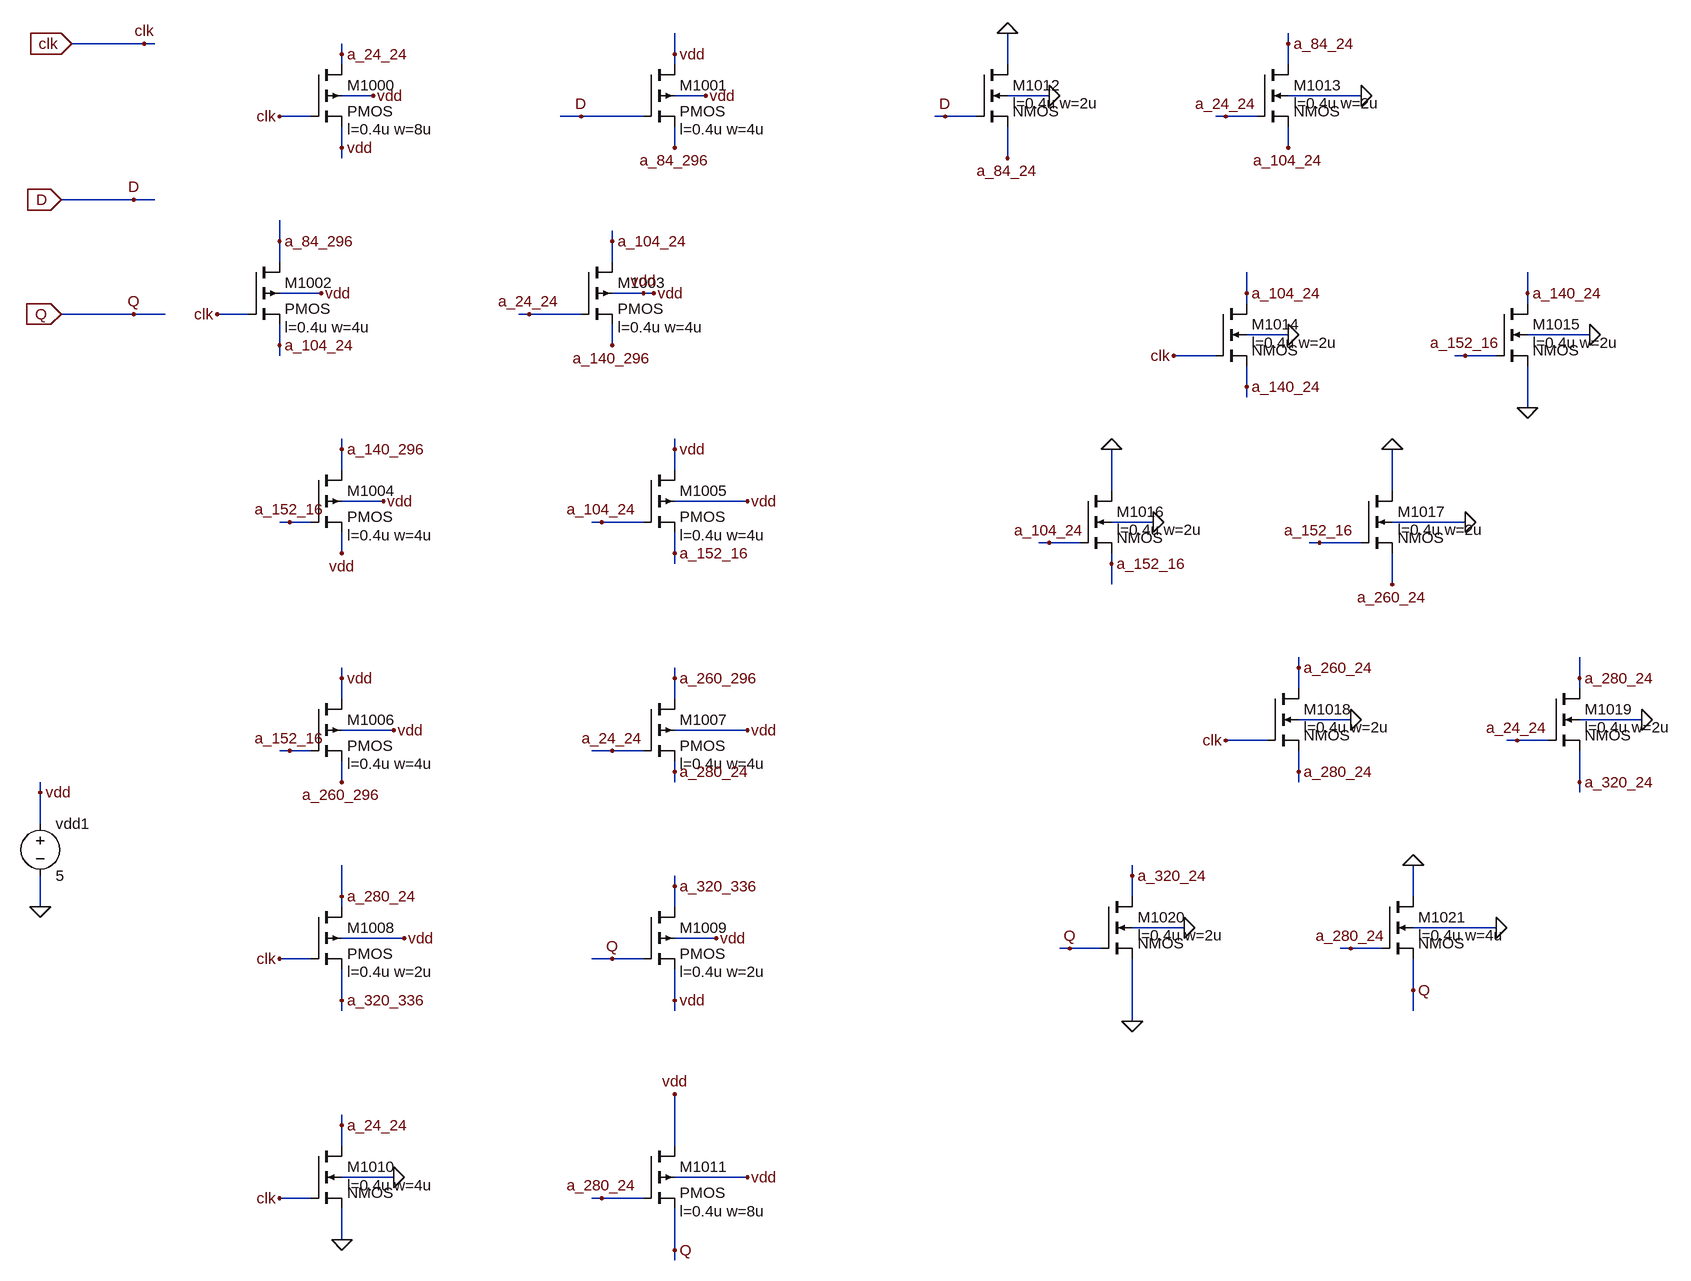
[diagram p0: schematic dff.asc]
dff.asc, the LTspice schematic file:
Version 4
SHEET 1 1748 1736
WIRE -624 -176 -736 -176
WIRE -608 -176 -624 -176
WIRE 1136 -176 1136 -192
WIRE -320 -160 -320 -176
WIRE 192 -160 192 -192
WIRE -320 -144 -320 -160
WIRE 192 -144 192 -160
WIRE 704 -144 704 -192
WIRE 1136 -144 1136 -176
WIRE -272 -96 -320 -96
WIRE 240 -96 192 -96
WIRE 768 -96 704 -96
WIRE 1248 -96 1136 -96
WIRE -368 -64 -416 -64
WIRE 48 -64 16 -64
WIRE 144 -64 48 -64
WIRE 608 -64 592 -64
WIRE 656 -64 608 -64
WIRE 1040 -64 1024 -64
WIRE 1088 -64 1040 -64
WIRE -320 -16 -320 -48
WIRE 192 -16 192 -48
WIRE 1136 -16 1136 -48
WIRE -320 0 -320 -16
WIRE 704 0 704 -48
WIRE -640 64 -752 64
WIRE -608 64 -640 64
WIRE -416 128 -416 96
WIRE 96 128 96 112
WIRE -416 160 -416 128
WIRE 96 160 96 128
WIRE -352 208 -416 208
WIRE 144 208 96 208
WIRE 160 208 144 208
WIRE 1072 208 1072 176
WIRE 1504 208 1504 176
WIRE 1072 224 1072 208
WIRE 1504 224 1504 208
WIRE -640 240 -752 240
WIRE -592 240 -640 240
WIRE -464 240 -512 240
WIRE -32 240 -48 240
WIRE 48 240 -32 240
WIRE 1136 272 1072 272
WIRE 1600 272 1504 272
WIRE -416 288 -416 256
WIRE 96 288 96 256
WIRE -416 304 -416 288
WIRE 1024 304 960 304
WIRE 1408 304 1392 304
WIRE 1456 304 1408 304
WIRE 1072 352 1072 320
WIRE 1072 368 1072 352
WIRE 1504 384 1504 320
WIRE -320 448 -320 432
WIRE 192 448 192 432
WIRE -320 480 -320 448
WIRE 192 480 192 448
WIRE 864 512 864 448
WIRE 1296 512 1296 448
WIRE -256 528 -320 528
WIRE 304 528 192 528
WIRE -400 560 -416 560
WIRE -368 560 -400 560
WIRE 80 560 64 560
WIRE 144 560 80 560
WIRE 928 560 864 560
WIRE 1408 560 1296 560
WIRE 768 592 752 592
WIRE 816 592 768 592
WIRE 1184 592 1168 592
WIRE 1248 592 1184 592
WIRE -320 608 -320 576
WIRE 192 608 192 576
WIRE 192 624 192 608
WIRE 864 624 864 608
WIRE 864 656 864 624
WIRE 1296 656 1296 608
WIRE 1152 784 1152 768
WIRE -320 800 -320 784
WIRE 192 800 192 784
WIRE 1584 800 1584 768
WIRE 1152 816 1152 784
WIRE 1584 816 1584 800
WIRE -320 832 -320 800
WIRE 192 832 192 800
WIRE 1232 864 1152 864
WIRE 1680 864 1584 864
WIRE -240 880 -320 880
WIRE 304 880 192 880
WIRE 1104 896 1040 896
WIRE 1488 896 1472 896
WIRE 1536 896 1488 896
WIRE -400 912 -416 912
WIRE -368 912 -400 912
WIRE 96 912 64 912
WIRE 144 912 96 912
WIRE 192 944 192 928
WIRE 1152 944 1152 912
WIRE -320 960 -320 928
WIRE 192 960 192 944
WIRE 1152 960 1152 944
WIRE 1584 960 1584 912
WIRE -784 976 -784 960
WIRE 1584 976 1584 960
WIRE -784 1024 -784 976
WIRE 896 1104 896 1088
WIRE 192 1120 192 1104
WIRE -320 1136 -320 1088
WIRE 896 1136 896 1104
WIRE 1328 1136 1328 1088
WIRE -784 1152 -784 1104
WIRE -320 1152 -320 1136
WIRE 192 1152 192 1120
WIRE 976 1184 896 1184
WIRE 1456 1184 1328 1184
WIRE -224 1200 -320 1200
WIRE 256 1200 192 1200
WIRE 800 1216 784 1216
WIRE 848 1216 800 1216
WIRE 1232 1216 1216 1216
WIRE 1280 1216 1232 1216
WIRE -368 1232 -416 1232
WIRE 96 1232 64 1232
WIRE 144 1232 96 1232
WIRE 1328 1280 1328 1232
WIRE -320 1296 -320 1248
WIRE 192 1296 192 1248
WIRE -320 1312 -320 1296
WIRE 192 1312 192 1296
WIRE 1328 1312 1328 1280
WIRE 896 1328 896 1232
WIRE -320 1488 -320 1472
WIRE -320 1520 -320 1488
WIRE 192 1520 192 1440
WIRE -240 1568 -320 1568
WIRE 304 1568 192 1568
WIRE -368 1600 -416 1600
WIRE 80 1600 64 1600
WIRE 144 1600 80 1600
WIRE -320 1664 -320 1616
WIRE 192 1680 192 1616
WIRE 192 1696 192 1680
FLAG -784 1152 0
FLAG -784 976 vdd
FLAG -736 -176 clk
IOPIN -736 -176 In
FLAG -752 64 D
IOPIN -752 64 In
FLAG -272 -96 vdd
FLAG 240 -96 vdd
FLAG 144 208 vdd
FLAG -352 208 vdd
FLAG -256 528 vdd
FLAG 304 528 vdd
FLAG 304 880 vdd
FLAG 256 1200 vdd
FLAG 304 1568 vdd
FLAG -224 1200 vdd
FLAG -240 880 vdd
FLAG 160 208 vdd
FLAG 768 -96 0
FLAG 1248 -96 0
FLAG 1600 272 0
FLAG 1136 272 0
FLAG 928 560 0
FLAG 1408 560 0
FLAG 1680 864 0
FLAG 1456 1184 0
FLAG 976 1184 0
FLAG 1232 864 0
FLAG -240 1568 0
FLAG -320 -16 vdd
FLAG 192 -160 vdd
FLAG -320 608 vdd
FLAG 192 448 vdd
FLAG -320 800 vdd
FLAG 192 1296 vdd
FLAG 192 1440 vdd
FLAG -624 -176 clk
FLAG -416 -64 clk
FLAG -512 240 clk
FLAG -416 1232 clk
FLAG -416 1600 clk
FLAG 960 304 clk
FLAG 1040 896 clk
FLAG -320 -160 a_24_24
FLAG -32 240 a_24_24
FLAG 96 912 a_24_24
FLAG -320 1488 a_24_24
FLAG 1040 -64 a_24_24
FLAG 1488 896 a_24_24
FLAG 192 -16 a_84_296
FLAG -416 128 a_84_296
FLAG -640 64 D
FLAG 48 -64 D
FLAG 608 -64 D
FLAG -416 288 a_104_24
FLAG 96 128 a_104_24
FLAG 80 560 a_104_24
FLAG 1136 -16 a_104_24
FLAG 1072 208 a_104_24
FLAG 768 592 a_104_24
FLAG 96 288 a_140_296
FLAG -320 448 a_140_296
FLAG -400 560 a_152_16
FLAG 192 608 a_152_16
FLAG -400 912 a_152_16
FLAG 1408 304 a_152_16
FLAG 864 624 a_152_16
FLAG 192 800 a_260_296
FLAG -320 960 a_260_296
FLAG 192 944 a_280_24
FLAG -320 1136 a_280_24
FLAG 80 1600 a_280_24
FLAG 1152 944 a_280_24
FLAG 1584 800 a_280_24
FLAG 1232 1216 a_280_24
FLAG -320 1296 a_320_336
FLAG 192 1120 a_320_336
FLAG -752 240 Q
IOPIN -752 240 In
FLAG -640 240 Q
FLAG 96 1232 Q
FLAG 192 1680 Q
FLAG 800 1216 Q
FLAG 1328 1280 Q
FLAG -320 1664 0
FLAG 704 -192 0
FLAG 1504 384 0
FLAG 864 448 0
FLAG 1296 448 0
FLAG 896 1328 0
FLAG 1328 1088 0
FLAG 704 0 a_84_24
FLAG 1136 -176 a_84_24
FLAG 1072 352 a_140_24
FLAG 1504 208 a_140_24
FLAG 1184 592 a_152_16
FLAG 1296 656 a_260_24
FLAG 1152 784 a_260_24
FLAG 1584 960 a_320_24
FLAG 896 1104 a_320_24
SYMBOL pmos4 -368 -144 R0
WINDOW 123 56 100 Left 2
SYMATTR Value2 l=0.4u w=8u
SYMATTR InstName M1000
SYMBOL pmos4 -464 160 R0
WINDOW 123 56 100 Left 2
SYMATTR Value2 l=0.4u w=4u
SYMATTR InstName M1002
SYMBOL pmos4 144 -144 R0
WINDOW 123 56 100 Left 2
SYMATTR Value2 l=0.4u w=4u
SYMATTR InstName M1001
SYMBOL pmos4 48 160 R0
WINDOW 123 56 100 Left 2
SYMATTR Value2 l=0.4u w=4u
SYMATTR InstName M1003
SYMBOL pmos4 -368 480 R0
WINDOW 123 56 100 Left 2
SYMATTR Value2 l=0.4u w=4u
SYMATTR InstName M1004
SYMBOL pmos4 -368 832 R0
WINDOW 123 56 100 Left 2
SYMATTR Value2 l=0.4u w=4u
SYMATTR InstName M1006
SYMBOL pmos4 144 480 R0
WINDOW 123 56 100 Left 2
SYMATTR Value2 l=0.4u w=4u
SYMATTR InstName M1005
SYMBOL pmos4 144 832 R0
WINDOW 123 56 100 Left 2
SYMATTR Value2 l=0.4u w=4u
SYMATTR InstName M1007
SYMBOL pmos4 -368 1152 R0
WINDOW 123 56 100 Left 2
SYMATTR Value2 l=0.4u w=2u
SYMATTR InstName M1008
SYMBOL pmos4 144 1152 R0
WINDOW 123 56 100 Left 2
SYMATTR Value2 l=0.4u w=2u
SYMATTR InstName M1009
SYMBOL nmos4 656 -144 R0
WINDOW 123 56 60 Left 2
SYMATTR Value2 l=0.4u w=2u
SYMATTR InstName M1012
SYMBOL nmos4 1088 -144 R0
WINDOW 123 56 60 Left 2
SYMATTR Value2 l=0.4u w=2u
SYMATTR InstName M1013
SYMBOL nmos4 1024 224 R0
WINDOW 123 56 60 Left 2
SYMATTR Value2 l=0.4u w=2u
SYMATTR InstName M1014
SYMBOL nmos4 1456 224 R0
WINDOW 123 56 60 Left 2
SYMATTR Value2 l=0.4u w=2u
SYMATTR InstName M1015
SYMBOL nmos4 816 512 R0
WINDOW 123 56 60 Left 2
SYMATTR Value2 l=0.4u w=2u
SYMATTR InstName M1016
SYMBOL nmos4 1248 512 R0
WINDOW 123 56 60 Left 2
SYMATTR Value2 l=0.4u w=2u
SYMATTR InstName M1017
SYMBOL nmos4 1104 816 R0
WINDOW 123 56 60 Left 2
SYMATTR Value2 l=0.4u w=2u
SYMATTR InstName M1018
SYMBOL nmos4 1536 816 R0
WINDOW 123 56 60 Left 2
SYMATTR Value2 l=0.4u w=2u
SYMATTR InstName M1019
SYMBOL nmos4 848 1136 R0
WINDOW 123 56 60 Left 2
SYMATTR Value2 l=0.4u w=2u
SYMATTR InstName M1020
SYMBOL nmos4 1280 1136 R0
WINDOW 123 56 60 Left 2
SYMATTR Value2 l=0.4u w=4u
SYMATTR InstName M1021
SYMBOL nmos4 -368 1520 R0
WINDOW 123 56 60 Left 2
SYMATTR Value2 l=0.4u w=4u
SYMATTR InstName M1010
SYMBOL pmos4 144 1520 R0
WINDOW 123 56 100 Left 2
SYMATTR Value2 l=0.4u w=8u
SYMATTR InstName M1011
SYMBOL voltage -784 1008 R0
SYMATTR InstName vdd1
SYMATTR Value 5

The netlist it stands for:
* dff.asc
M1000 a_24_24 clk vdd vdd PMOS l=0.4u w=8u
M1002 a_84_296 clk a_104_24 vdd PMOS l=0.4u w=4u
M1001 vdd D a_84_296 vdd PMOS l=0.4u w=4u
M1003 a_104_24 a_24_24 a_140_296 vdd PMOS l=0.4u w=4u
M1004 a_140_296 a_152_16 vdd vdd PMOS l=0.4u w=4u
M1006 vdd a_152_16 a_260_296 vdd PMOS l=0.4u w=4u
M1005 vdd a_104_24 a_152_16 vdd PMOS l=0.4u w=4u
M1007 a_260_296 a_24_24 a_280_24 vdd PMOS l=0.4u w=4u
M1008 a_280_24 clk a_320_336 vdd PMOS l=0.4u w=2u
M1009 a_320_336 Q vdd vdd PMOS l=0.4u w=2u
M1012 0 D a_84_24 0 NMOS l=0.4u w=2u
M1013 a_84_24 a_24_24 a_104_24 0 NMOS l=0.4u w=2u
M1014 a_104_24 clk a_140_24 0 NMOS l=0.4u w=2u
M1015 a_140_24 a_152_16 0 0 NMOS l=0.4u w=2u
M1016 0 a_104_24 a_152_16 0 NMOS l=0.4u w=2u
M1017 0 a_152_16 a_260_24 0 NMOS l=0.4u w=2u
M1018 a_260_24 clk a_280_24 0 NMOS l=0.4u w=2u
M1019 a_280_24 a_24_24 a_320_24 0 NMOS l=0.4u w=2u
M1020 a_320_24 Q 0 0 NMOS l=0.4u w=2u
M1021 0 a_280_24 Q 0 NMOS l=0.4u w=4u
M1010 a_24_24 clk 0 0 NMOS l=0.4u w=4u
M1011 vdd a_280_24 Q vdd PMOS l=0.4u w=8u
vdd1 vdd 0 5
.model NMOS NMOS
.model PMOS PMOS
.lib standard.mos
.backanno
.end